# EAGLE design VM Protection Circuit (EAGLE 6.3)
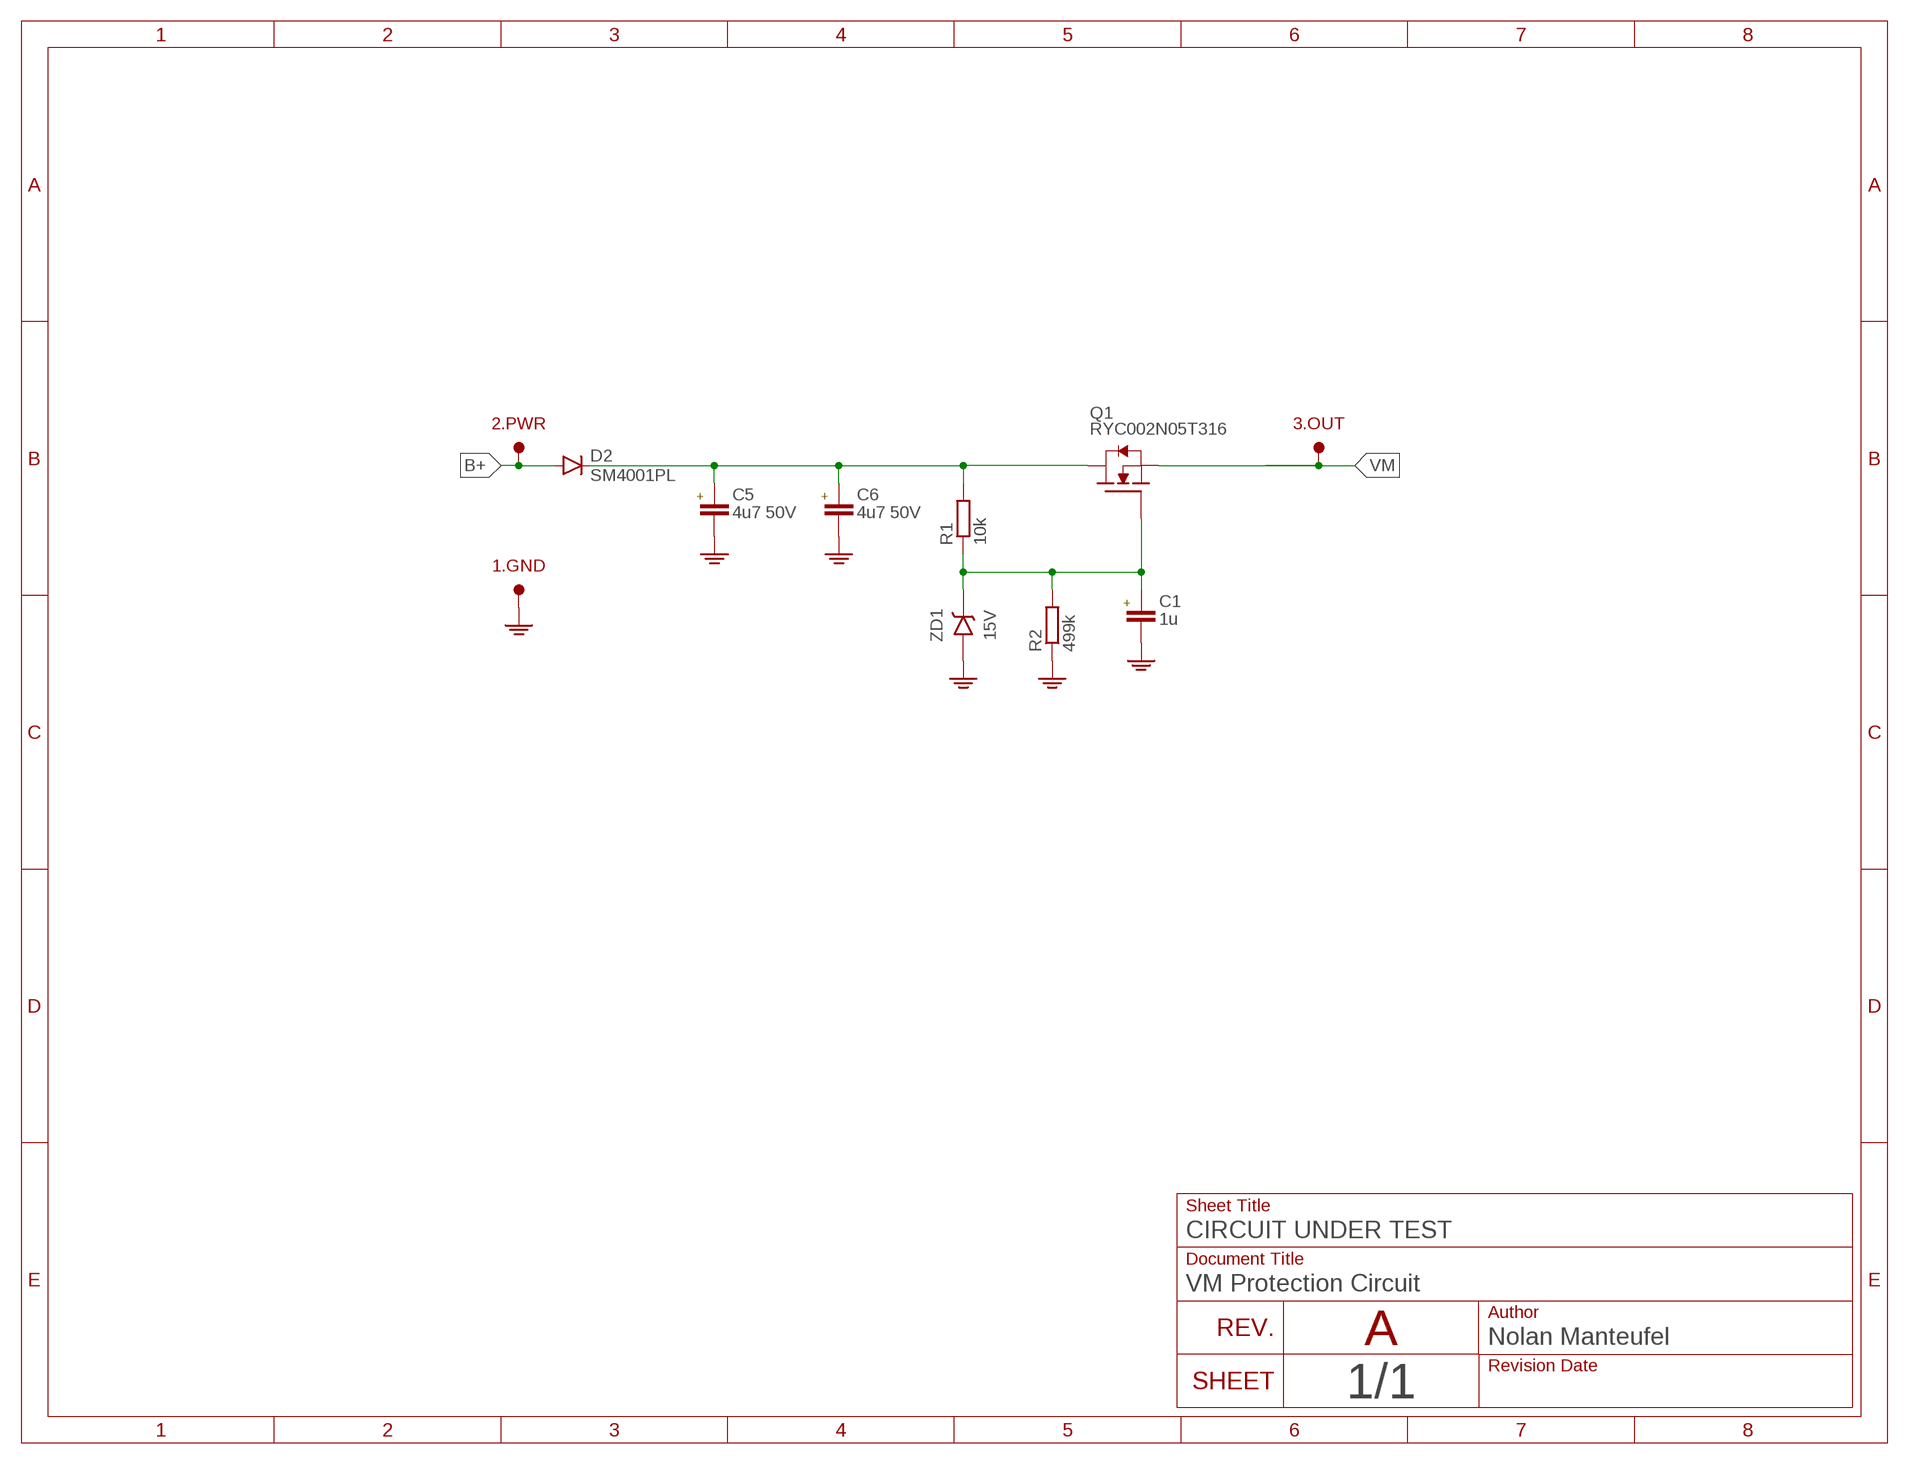
[diagram p0: schematic, sheet 1]

## Parts
1.GND  TESTPOINTKE5000-SMTEXT  [PINS_1_TESTPOINT_KE5000_NOTEXT]
2.PWR  TESTPOINTKE5000-SMTEXT  [PINS_1_TESTPOINT_KE5000_NOTEXT]
3.OUT  TESTPOINTKE5000-SMTEXT  [PINS_1_TESTPOINT_KE5000_NOTEXT]
C1  1u  C-EUC0402  [C0402]
C5  4u7 50V  C-EUC0805  [C0805]
C6  4u7 50V  C-EUC0805  [C0805]
D2  SM4001PL  DIODE-SOD123  [SOD123]
Q1  RYC002N05T316  MOSFET-NSOT23  [SOT23]
R1  10k  R-EU_R0402  [R0402]
R2  499k  R-EU_R0402  [R0402]
ZD1  15V  ZENER-DIODESOT23  [SOT23]

## Nets
B+: 2.PWR.1 D2.A
GND: 1.GND.1 C1.2 C5.2 C6.2 R2.1 ZD1.1(A)
Q1.DRAIN: C5.1 C6.1 D2.C Q1.3(D) R1.2
Q1.GATE: C1.1 Q1.1(G) R1.1 R2.2 ZD1.3(C)
VM: 3.OUT.1 Q1.2(S)

## Notes on the sheet
- A

## Library data of the parts
1.GND 2.PWR 3.OUT = nolan:TESTPOINT
C1 C5 C6 = nolan:C-EU: CAPACITOR, European symbol
D2 = nolan:DIODE-: DIODE
Q1 = nolan:MOSFET-N
R1 R2 = nolan:R-EU_: RESISTOR, European symbol
ZD1 = nolan:ZENER-DIODE: Z-Diode

## Board
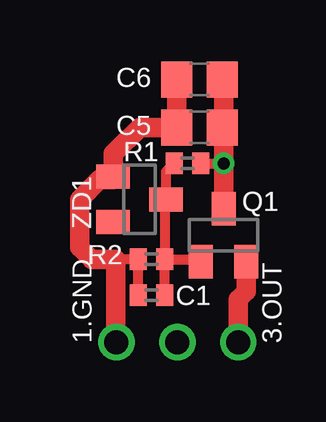
[diagram p1: board, top side]
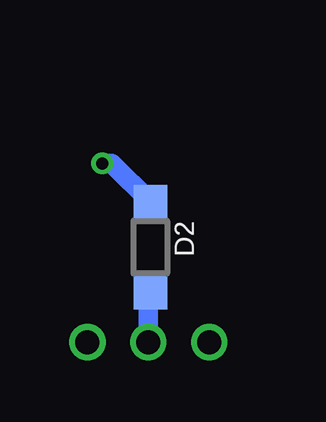
[diagram p2: board, bottom side, seen from below]

No outline drawn. Coordinates in mm, seen from the top.
Copper layers (1*16): Top 0.035mm / dielectric 1.5mm / Bottom 0.035mm
Design rules "default *": minimum track width 10mil, minimum drill 24mil, track to track 8mil, track to pad 8mil, pad to pad 8mil, via to via 8mil, smd to smd 8mil, copper to edge 40mil, drill to drill 8mil, minimum pad ring 10mil, minimum via ring 8mil, stop-mask expansion 4mil, vias tented up to drill 20mil, thermal gap 10mil

### Footprints (pad centres in the part's own frame; a part is rotated, then mirrored left to right if it is on the bottom)
PINS_1_TESTPOINT_KE5000_NOTEXT = drill 1: 1 0,0
C0402 = smd 0.7 x 0.9: 1 -0.55,0; 2 0.55,0
C0805 = smd 1.3 x 1.5: 1 -0.95,0; 2 0.95,0
SOD123 = smd 1.4 x 1.4: A 1.9,0; C -1.9,0
SOT23 = smd 1 x 1.4: 1 -0.95,-1.1; 2 0.95,-1.1; 3 0,1.1
R0402 = smd 0.7 x 0.9: 1 -0.55,0; 2 0.55,0

### Placement (x,y rotation side)
1.GND  2.54,2.54 90 top
2.PWR  5.08,2.54 180 top
3.OUT  7.62,2.54 270 top
C1  4,4.5 180 top
C5  6,11.5 180 top
C6  6,13.5 180 top
D2  5,6.5 270 bottom
Q1  7,7 0 top
R1  5.5,10 0 top
R2  4,6 0 top
ZD1  3.5,8.5 270 top

### Tracks (layer width: path | path; a pad name or v marks a point on that pad's centre or on a via)
B+
  Bottom 0.406: D2.A 5.08,4.52
  Bottom 0.813: 5.08,4.52 2.PWR.1
GND
  Top 0.406: 2.4,9.32 ZD1.1 | 2.5,6 R2.1 C1.2
  Top 0.813: C6.2 C5.2 3.5,11.5 2.4,10.4 ZD1.1 | 1.GND.1 2.5,2.58 2.5,6 1.5,6 1,6.5 1,8.5 1.82,9.32 2.4,9.32
Q1.DRAIN  (via drill 0.5)
  Top 0.406: R1.2 v7,10
  Top 0.813: Q1.3 v7,10 7,11.45 | 7,11.45 C5.1 | C6.1 7,13.45 7,11.45
  Bottom 0.813: D2.C 6.6,10 v7,10
Q1.GATE
  Top 0.406: R1.1 4.6,9.65 ZD1.3 4.55,8.45 R2.2 | R2.2 5.95,6 Q1.1 | C1.1 R2.2
VM
  Top 0.813: Q1.2 7.95,4.65 7.62,4.32 3.OUT.1

### Text on the board
_tNames: C6 | C5 | R1 | Q1 | ZD1 | R2 | C1 | 1.GND | 3.OUT
_bNames: D2